# EAGLE schematic LRC (EAGLE 5.11)
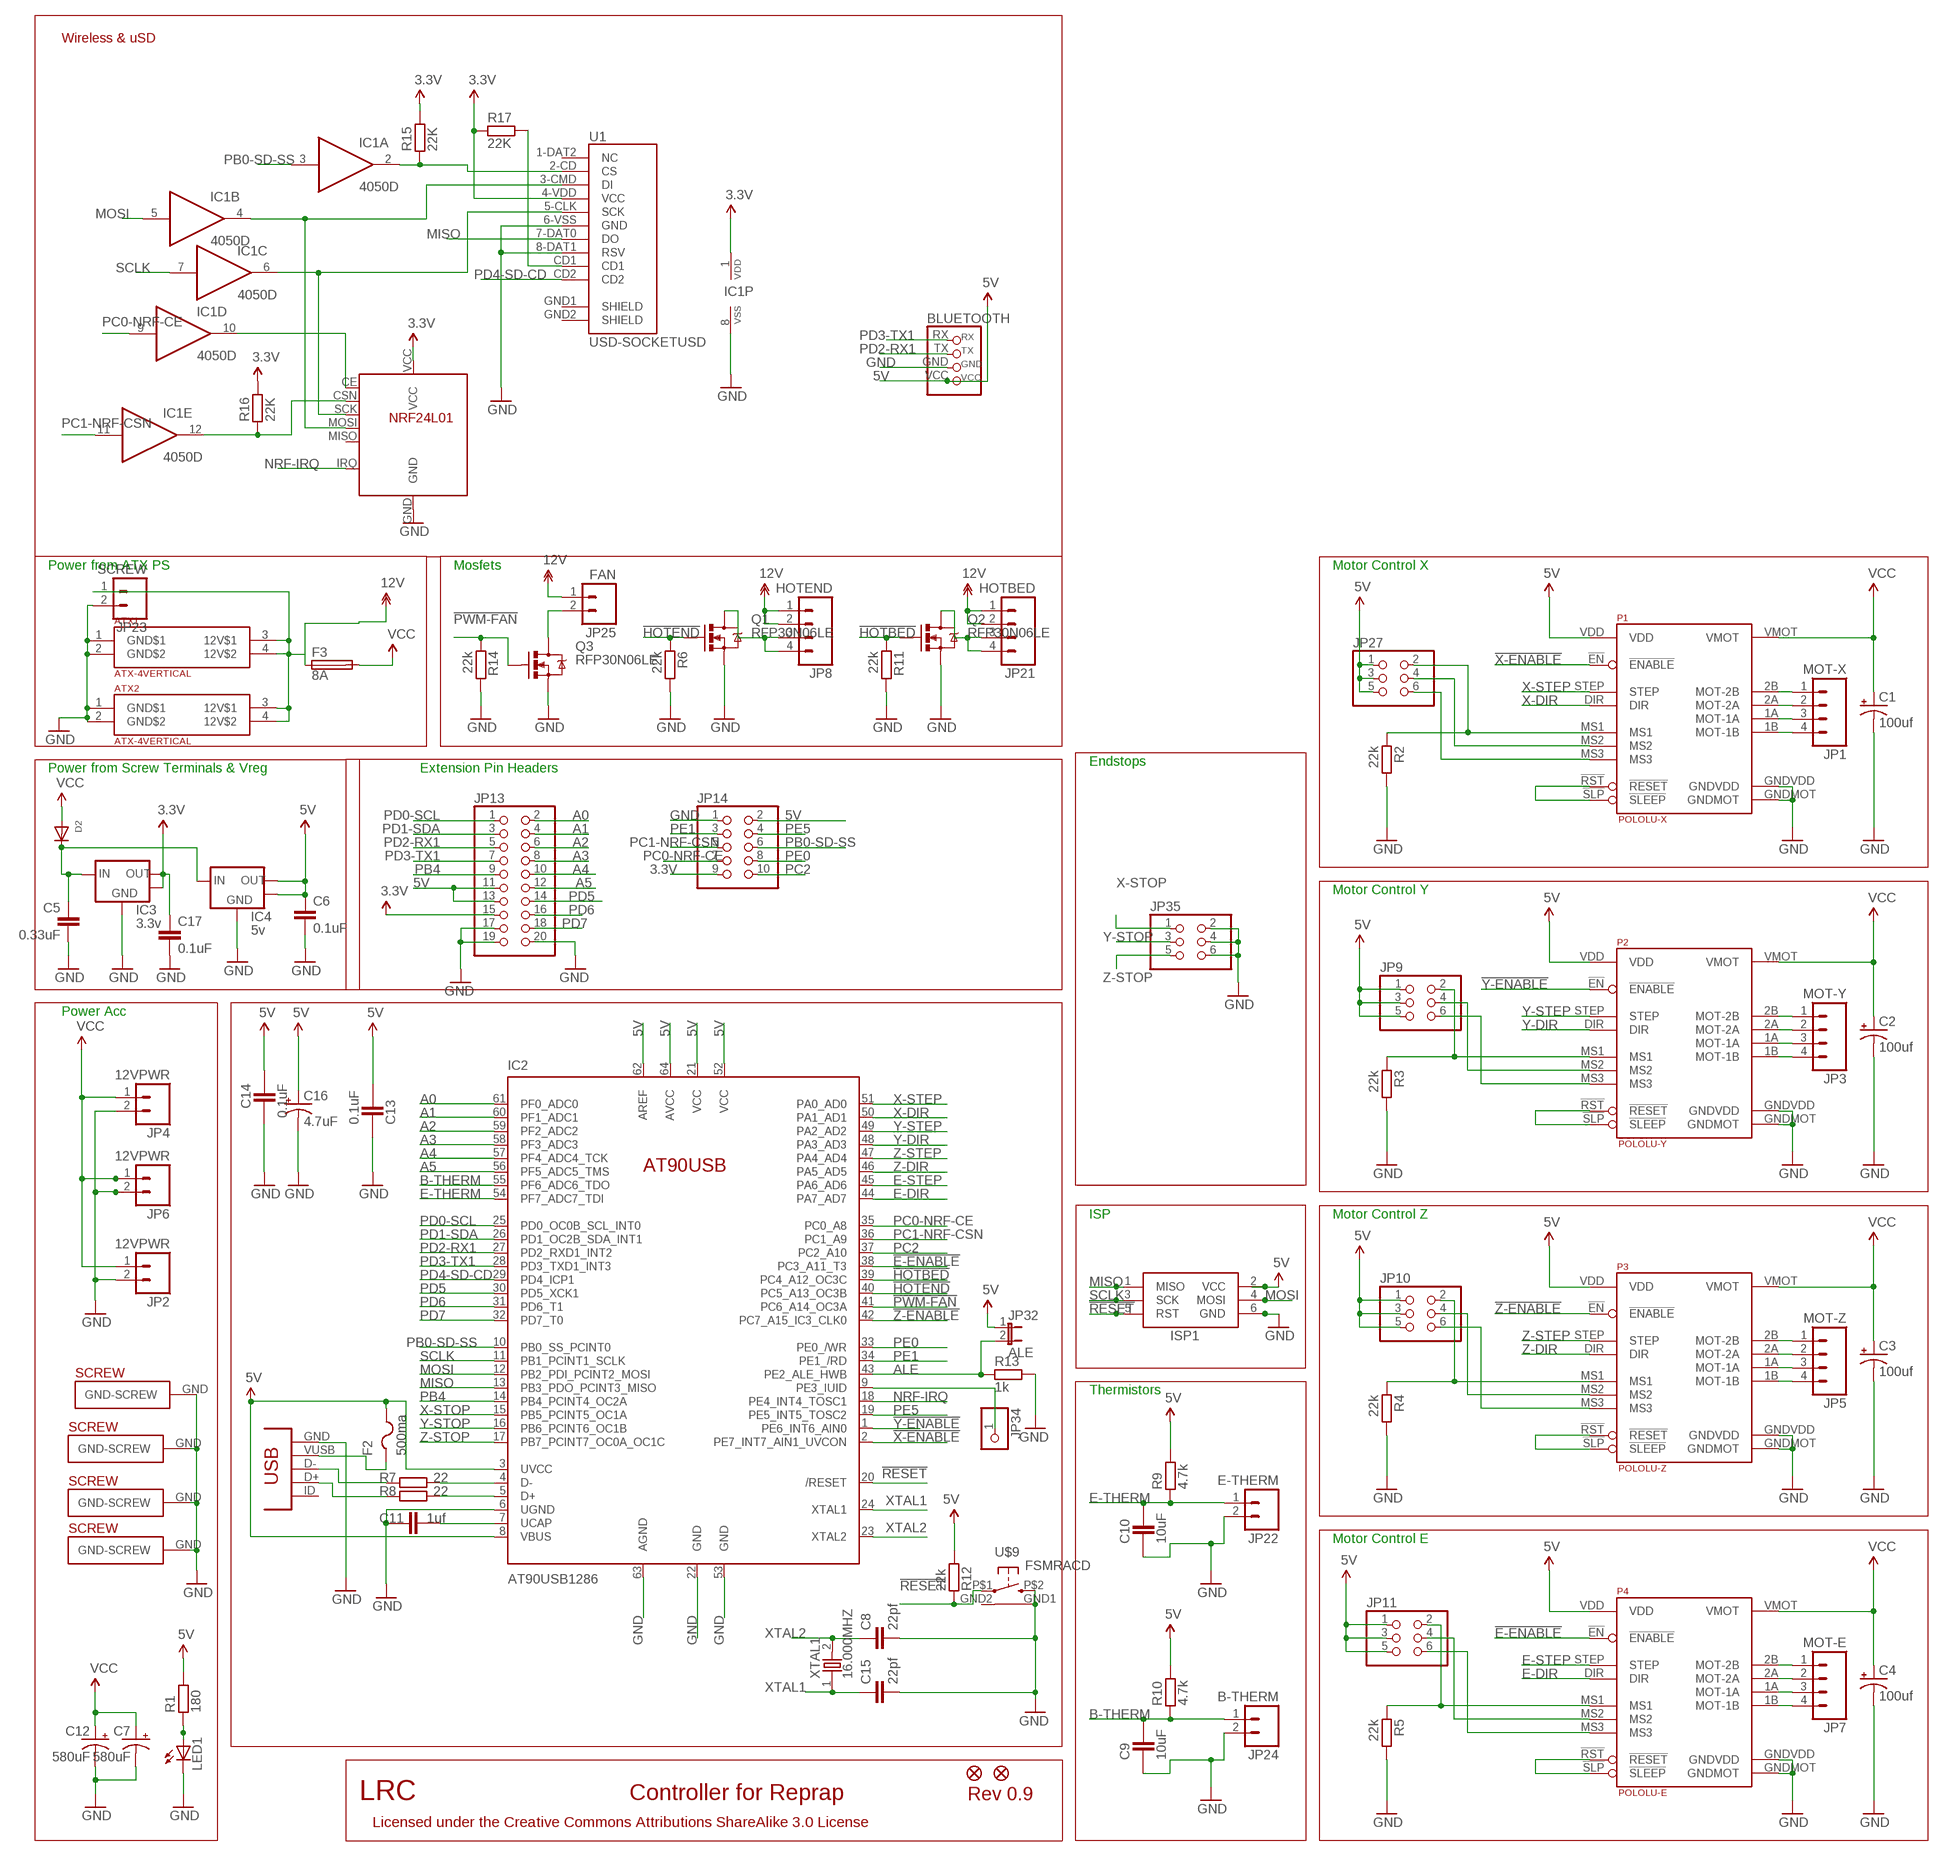
[diagram p0: schematic, sheet 1]

## Parts
ATX1  ATX-4VERTICAL  [MINIFITJR-4-VERTICAL]
ATX2  ATX-4VERTICAL  [MINIFITJR-4-VERTICAL]
BLUETOOTH  BLUETOOTH-BREAKOUT  [BLUETOOTH-BREAKOUT1X04]
C1  100uf  CAP_POLPTH1  [CPOL-RADIAL-100UF-25V]
C2  100uf  CAP_POLPTH1  [CPOL-RADIAL-100UF-25V]
C3  100uf  CAP_POLPTH1  [CPOL-RADIAL-100UF-25V]
C4  100uf  CAP_POLPTH1  [CPOL-RADIAL-100UF-25V]
C5  0.33uF  CAPPTH2  [CAP-PTH-SMALL2]
C6  0.1uF  CAPPTH2  [CAP-PTH-SMALL2]
C7  580uF  CAP_POLPTH4  [CPOL-RADIAL-1000UF-25V]
C8  22pf  CAPC805  [C805]
C9  10uF  CAPACITOR_0805  [CAPC2012X145AN]
C10  10uF  CAPACITOR_0805  [CAPC2012X145AN]
C11  1uf  CAPACITOR_0805  [CAPC2012X145AN]
C12  580uF  CAP_POLPTH4  [CPOL-RADIAL-1000UF-25V]
C13  0.1uF  CAPACITOR_0805  [CAPC2012X145AN]
C14  0.1uF  CAPACITOR_0805  [CAPC2012X145AN]
C15  22pf  CAPC805  [C805]
C16  4.7uF  CAP_POLPTH2  [CPOL-RADIAL-10UF-25V]
C17  0.1uF  CAPPTH2  [CAP-PTH-SMALL2]
D2  DIODESMA  [SMADIODE]
F2  500ma  PTCFUSE-1206  [R1206]
F3  8A  PTCFUSE  [LITTLEFUSE]
IC1  4050D  [SO16]
IC2  AT90USB1286  AT90USB  [TQFP64-2]
IC3  3.3v  V_REG_LM1117SOT223  [SOT223]
IC4  5v  V_REG_LM1117SOT223  [SOT223]
ISP1  AVRISP-6  [AVRISP]
JP1  MOT-X  M04POLAR  [MOLEX-1X4]
JP2  12VPWR  M02POLAR  [MOLEX-1X2]
JP3  MOT-Y  M04POLAR  [MOLEX-1X4]
JP4  12VPWR  M02POLAR  [MOLEX-1X2]
JP5  MOT-Z  M04POLAR  [MOLEX-1X4]
JP6  12VPWR  M02POLAR  [MOLEX-1X2]
JP7  MOT-E  M04POLAR  [MOLEX-1X4]
JP8  HOTEND  M04POLAR  [MOLEX-1X4]
JP9  PINHD-2X3  [2X03]
JP10  PINHD-2X3  [2X03]
JP11  PINHD-2X3  [2X03]
JP13  PINHD-2X10  [2X10]
JP14  PINHD-2X5  [2X05]
JP21  HOTBED  M04POLAR  [MOLEX-1X4]
JP22  E-THERM  M02PTH  [1X02]
JP23  SCREW  M025MM  [SCREWTERMINAL-5MM-2]
JP24  B-THERM  M02PTH  [1X02]
JP25  FAN  M02PTH  [1X02]
JP26  FIDUCIAL1X2.5  [FIDUCIAL-1X2.5]
JP27  PINHD-2X3  [2X03]
JP32  ALE  JUMPER-2PTH  [1X02]
JP33  FIDUCIAL1X2.5  [FIDUCIAL-1X2.5]
JP34  PINHD-1X1  [1X01]
JP35  PINHD-2X3  [2X03]
LED1  LEDCHIPLED_1206  [CHIPLED_1206]
P1  POLOLU-X  POLOLU-ALLEGRO  [POLOLU-ALLEGRO-PTH]
P2  POLOLU-Y  POLOLU-ALLEGRO  [POLOLU-ALLEGRO-PTH]
P3  POLOLU-Z  POLOLU-ALLEGRO  [POLOLU-ALLEGRO-PTH]
P4  POLOLU-E  POLOLU-ALLEGRO  [POLOLU-ALLEGRO-PTH]
Q1  RFP30N06LE  MOSFET-NCHANNELPTH2  [TO220V]
Q2  RFP30N06LE  MOSFET-NCHANNELPTH2  [TO220V]
Q3  RFP30N06LE  MOSFET-NCHANNELPTH2  [TO220V]
R1  180  RESISTOR_0805  [RESC2012X70N]
R2  22k  RESISTOR_0805  [RESC2012X70N]
R3  22k  RESISTOR_0805  [RESC2012X70N]
R4  22k  RESISTOR_0805  [RESC2012X70N]
R5  22k  RESISTOR_0805  [RESC2012X70N]
R6  22k  RESISTOR_0805  [RESC2012X70N]
R7  22  RESISTOR_0805  [RESC2012X70N]
R8  22  RESISTOR_0805  [RESC2012X70N]
R9  4.7k  RESISTOR_0805  [RESC2012X70N]
R10  4.7k  RESISTOR_0805  [RESC2012X70N]
R11  22k  RESISTOR_0805  [RESC2012X70N]
R12  22k  RESISTOR_0805  [RESC2012X70N]
R13  1k  RESISTOR_0805  [RESC2012X70N]
R14  22k  RESISTOR_0805  [RESC2012X70N]
R15  22K  RESISTOR_0805  [RESC2012X70N]
R16  22K  RESISTOR_0805  [RESC2012X70N]
R17  22K  RESISTOR_0805  [RESC2012X70N]
RF1  NRF24L01-BREAKOUT  [NRF24L01-BREAKOUT-ITEAD]
U1  USD-SOCKETUSD  [USD-SOCKET-PP]
U$8  PLATED-SCREW  [PLATEDSCREW]
U$9  FSMRACD  [FSMRACD]
U$17  PLATED-SCREW  [PLATEDSCREW]
U$24  PLATED-SCREW  [PLATEDSCREW]
U$37  PLATED-SCREW  [PLATEDSCREW]
USB1  CON-USB-MINI-BUSB1  [CONN_USB_MINI-B]
XTAL1  16.000MHZ  OSC-XTAL  [HC-49U-OR-DIP]

## Nets
3.3V: C17.1 IC1.1(P:VDD) IC3.2(VR-OUTSM) IC3.4(OUT) JP13.15 JP14.9 R15.2 R16.2 R17.1 RF1.VCC U1.4-VDD(VCC)
5V: BLUETOOTH.VCC(4.VCC) C6.1 C13.2 C14.1 C16.1(+) F2.2 IC2.3(UVCC) IC2.8(VBUS) IC2.21(VCC) IC2.52(VCC) IC2.62(AREF) IC2.64(AVCC) IC4.2(VR-OUTSM) IC4.4(OUT) ISP1.2(VCC) JP9.1 JP9.3 JP9.5 JP10.1 JP10.3 JP10.5 JP11.1 JP11.3 JP11.5 JP13.11 JP13.13 JP14.2 JP27.1 JP27.3 JP27.5 JP32.1 P1.VDD P2.VDD P3.VDD P4.VDD R1.2 R9.2 R10.2 R12.2
12V: ATX1.3(12V$1) ATX1.4(12V$2) ATX2.3(12V$1) ATX2.4(12V$2) F3.1 JP8.1 JP8.2 JP21.1 JP21.2 JP23.1 JP25.1
!E-ENABLE: IC2.38(PC3_A11_T3) P4.!EN(!ENABLE)
!HOTBED: IC2.39(PC4_A12_OC3C) Q2.1(G) R11.1
!HOTEND: IC2.40(PC5_A13_OC3B) Q1.1(G) R6.1
!PWM-FAN: IC2.41(PC6_A14_OC3A) Q3.1(G) R14.1
!RESET: IC2.20(/RESET) ISP1.5(RST) R12.1 U$9.P$1(P)
!X-ENABLE: IC2.2(PE7_INT7_AIN1_UVCON) P1.!EN(!ENABLE)
!Y-ENABLE: IC2.1(PE6_INT6_AIN0) P2.!EN(!ENABLE)
!Z-ENABLE: IC2.42(PC7_A15_IC3_CLK0) P3.!EN(!ENABLE)
A0: IC2.61(PF0_ADC0) JP13.2
A1: IC2.60(PF1_ADC1) JP13.4
A2: IC2.59(PF2_ADC2) JP13.6
A3: IC2.58(PF3_ADC3) JP13.8
A4: IC2.57(PF4_ADC4_TCK) JP13.10
A5: IC2.56(PF5_ADC5_TMS) JP13.12
ALE: IC2.43(PE2_ALE_HWB) JP32.2 R13.1
B-THERM: C9.2 IC2.55(PF6_ADC6_TDO) JP24.1 R10.1
E-DIR: IC2.44(PA7_AD7) P4.DIR
E-MOT-1A [power]: JP7.3 P4.1A(MOT-1A)
E-MOT-1B [power]: JP7.4 P4.1B(MOT-1B)
E-MOT-2A [power]: JP7.2 P4.2A(MOT-2A)
E-MOT-2B [power]: JP7.1 P4.2B(MOT-2B)
E-MS1: JP11.2 P4.MS1 R5.1
E-MS2: JP11.4 P4.MS2
E-MS3: JP11.6 P4.MS3
E-RESETSLEEP: P4.!RST(!RESET) P4.!SLP(!SLEEP)
E-STEP: IC2.45(PA6_AD6) P4.STEP
E-THERM: C10.2 IC2.54(PF7_ADC7_TDI) JP22.1 R9.1
GND [power]: ATX1.1(GND$1) ATX1.2(GND$2) ATX2.1(GND$1) ATX2.2(GND$2) BLUETOOTH.GND(3.GND) C1.2(-) C2.2(-) C3.2(-) C4.2(-) C5.2 C6.2 C7.2(-) C8.2 C9.1 C10.1 C11.1 C12.2(-) C13.1 C14.2 C15.2 C16.2(-) C17.2 IC1.8(P:VSS) IC2.6(UGND) IC2.22(GND) IC2.53(GND) IC2.63(AGND) IC3.1(GND) IC4.1(GND) ISP1.6(GND) JP2.2 JP4.2 JP6.2 JP13.17 JP13.19 JP13.20 JP14.1 JP22.2 JP23.2 JP24.2 JP35.2 JP35.4 JP35.6 LED1.C P1.GNDMOT P1.GNDVDD P2.GNDMOT P2.GNDVDD P3.GNDMOT P3.GNDVDD P4.GNDMOT P4.GNDVDD Q1.3(S) Q2.3(S) Q3.3(S) R2.2 R3.2 R4.2 R5.2 R6.2 R11.2 R13.2 R14.2 RF1.GND U1.6-VSS(GND) U1.8-DAT1(RSV) U$8.GND(GND-SCREW) U$9.GND1 U$9.P$2(S) U$17.GND(GND-SCREW) U$24.GND(GND-SCREW) U$37.GND(GND-SCREW) USB1.GND
HOTBED-GND [power]: JP21.3 JP21.4 Q2.2(D)
HOTEND-GND [power]: JP8.3 JP8.4 Q1.2(D)
MISO: IC2.13(PB3_PDO_PCINT3_MISO) ISP1.1(MISO) U1.7-DAT0(DO)
MOSI: IC1.5(B:I) IC2.12(PB2_PDI_PCINT2_MOSI) ISP1.4(MOSI)
N$1: LED1.A R1.1
N$2: R7.1 USB1.D-
N$3: IC2.4(D-) R7.2
N$4: IC2.5(D+) R8.2
N$5: R8.1 USB1.D+
N$6: JP25.2 Q3.2(D)
N$7: IC2.9(PE3_IUID) JP34.1
N$8: F2.1 USB1.VUSB
N$9: C11.2 IC2.7(UCAP)
N$10: R17.2 U1.CD1
N$11: IC1.12(E:O) R16.1 RF1.CSN
N$12: IC1.2(A:O) R15.1 U1.2-CD(CS)
N$13: IC1.4(B:O) RF1.MOSI U1.3-CMD(DI)
N$14: IC1.10(D:O) RF1.CE
N$16: C5.1 D2.C IC3.3(IN) IC4.3(IN)
N$17: IC1.6(C:O) RF1.SCK U1.5-CLK(SCK)
NRF-IRQ: IC2.18(PE4_INT4_TOSC1) RF1.IRQ
PB0-SD-SS: IC1.3(A:I) IC2.10(PB0_SS_PCINT0) JP14.6
PB4: IC2.14(PB4_PCINT4_OC2A) JP13.9
PC0-NRF-CE: IC1.9(D:I) IC2.35(PC0_A8) JP14.7
PC1-NRF-CSN: IC1.11(E:I) IC2.36(PC1_A9) JP14.5
PC2: IC2.37(PC2_A10) JP14.10
PD0-SCL: IC2.25(PD0_OC0B_SCL_INT0) JP13.1
PD1-SDA: IC2.26(PD1_OC2B_SDA_INT1) JP13.3
PD2-RX1: BLUETOOTH.TX(2.TX) IC2.27(PD2_RXD1_INT2) JP13.5
PD3-TX1: BLUETOOTH.RX(1.RX) IC2.28(PD3_TXD1_INT3) JP13.7
PD4-SD-CD: IC2.29(PD4_ICP1) U1.CD2
PD5: IC2.30(PD5_XCK1) JP13.14
PD6: IC2.31(PD6_T1) JP13.16
PD7: IC2.32(PD7_T0) JP13.18
PE0: IC2.33(PE0_/WR) JP14.8
PE1: IC2.34(PE1_/RD) JP14.3
PE5: IC2.19(PE5_INT5_TOSC2) JP14.4
SCLK: IC1.7(C:I) IC2.11(PB1_PCINT1_SCLK) ISP1.3(SCK)
VCC: C1.1(+) C2.1(+) C3.1(+) C4.1(+) C7.1(+) C12.1(+) D2.A F3.2 JP2.1 JP4.1 JP6.1 P1.VMOT P2.VMOT P3.VMOT P4.VMOT
X-DIR: IC2.50(PA1_AD1) P1.DIR
X-MOT-1A [power]: JP1.3 P1.1A(MOT-1A)
X-MOT-1B [power]: JP1.4 P1.1B(MOT-1B)
X-MOT-2A [power]: JP1.2 P1.2A(MOT-2A)
X-MOT-2B [power]: JP1.1 P1.2B(MOT-2B)
X-MS1: JP27.2 P1.MS1 R2.1
X-MS2: JP27.4 P1.MS2
X-MS3: JP27.6 P1.MS3
X-RESETSLEEP: P1.!RST(!RESET) P1.!SLP(!SLEEP)
X-STEP: IC2.51(PA0_AD0) P1.STEP
X-STOP: IC2.15(PB5_PCINT5_OC1A) JP35.1
XTAL1: C15.1 IC2.24(XTAL1) XTAL1.1
XTAL2: C8.1 IC2.23(XTAL2) XTAL1.2
Y-DIR: IC2.48(PA3_AD3) P2.DIR
Y-MOT-1A [power]: JP3.3 P2.1A(MOT-1A)
Y-MOT-1B [power]: JP3.4 P2.1B(MOT-1B)
Y-MOT-2A [power]: JP3.2 P2.2A(MOT-2A)
Y-MOT-2B [power]: JP3.1 P2.2B(MOT-2B)
Y-MS1: JP9.2 P2.MS1 R3.1
Y-MS2: JP9.4 P2.MS2
Y-MS3: JP9.6 P2.MS3
Y-RESETSLEEP: P2.!RST(!RESET) P2.!SLP(!SLEEP)
Y-STEP: IC2.49(PA2_AD2) P2.STEP
Y-STOP: IC2.16(PB6_PCINT6_OC1B) JP35.3
Z-DIR: IC2.46(PA5_AD5) P3.DIR
Z-MOT-1A [power]: JP5.3 P3.1A(MOT-1A)
Z-MOT-1B [power]: JP5.4 P3.1B(MOT-1B)
Z-MOT-2A [power]: JP5.2 P3.2A(MOT-2A)
Z-MOT-2B [power]: JP5.1 P3.2B(MOT-2B)
Z-MS1: JP10.2 P3.MS1 R4.1
Z-MS2: JP10.4 P3.MS2
Z-MS3: JP10.6 P3.MS3
Z-RESETSLEEP: P3.!RST(!RESET) P3.!SLP(!SLEEP)
Z-STEP: IC2.47(PA4_AD4) P3.STEP
Z-STOP: IC2.17(PB7_PCINT7_OC0A_OC1C) JP35.5
Unconnected: IC1.14(F:I) IC1.15(F:O) RF1.MISO U1.1-DAT2(NC) U1.GND1(SHIELD) U1.GND2(SHIELD) U$9.GND2 USB1.BODY@1(BODY) USB1.BODY@2(BODY) USB1.BODY@3(BODY) USB1.BODY@4(BODY) USB1.ID(USBID)

## Notes on the sheet
- Wireless & uSD
- Power from ATX PS | Mosfets | Motor Control X
- Endstops
- Power from Screw Terminals & Vreg | Extension Pin Headers
- Motor Control Y
- Power Acc
- ISP | Motor Control Z
- Thermistors
- Motor Control E
- LRC | Controller for Reprap | Rev 0.9
- Licensed under the Creative Commons Attributions ShareAlike 3.0 License

## Library data of the parts
ATX1 ATX2 = atx-power-supply:ATX-4
BLUETOOTH = LL:BLUETOOTH-BREAKOUT: PIN HEADER
C1-C4 C7 C12 C16 = SparkFun:CAP_POL: Capacitor Polarized These are standard SMD and PTH capacitors. Normally 10uF, 47uF, and 100uF in electrolytic and tantalum varieties. Always verify the external diameter of the through hole cap, it varies with capacity, voltage, and manufacturer. The EIA devices should be standard.
C5 C6 C17 = SparkFun:CAP: Capacitor Standard 0603 ceramic capacitor, and 0.1" leaded capacitor.
C8 C15 = dp_devices:CAP
C9-C11 C13 C14 = ipc-7351-capacitor:CAPACITOR_
D2 = adafruit:DIODE: Diode SMADIODE - SMA Surface Mount Package 20V 1A Schottky Diode Digikey: 641-1014-6-ND DO-1N4148 - Through Hole Small Current Diode SOD-123 20V 1 A (.5mV Vf) Schottky Diode - Digikey: MBRX120TPMSCT-ND SOD-323 10V 570mA (.38mV Vf, 3ns) Schottky Diode - Digikey: ZLLS410CT-ND SOD-523 30V 30mA Schottky Diode (RB751S-40TE61) - Digikey: RB751S-40TE61CT-ND SOT23-R/W - SOT23 Package (R = Solder Paste/Reflow Ovens, W = Hand-Soldering) BAT54Film 40V 300mA - Digikey: 497-7162-1-ND
F2 = adafruit:PTCFUSE: PTC fuses, resettable thermistors
F3 = RepRapjr:PTCFUSE: LITTLEFUSE Picofuse/slow Littlefuse
IC1 = 40xx:4050: Hex non-inverting BUFFER
IC2 = Atmel-at90usb-teensy:AT90USB
IC3 IC4 = LL:V_REG_LM1117: Voltage Regulator LM1117 Standard adjustable voltage regulator but in SMD form. Fixed voltage type.
ISP1 = adafruit:AVRISP: AVR ISP HEADER Standard 6 pin header for AVR programming
JP1 JP3 JP5 JP7 JP8 JP21 = SparkFun:M04: Header 4 Standard 4-pin 0.1" header. Use with straight break away headers (SKU : PRT-00116), right angle break away headers (PRT-00553), swiss pins (PRT-00743), machine pins (PRT-00117), and female headers (PRT-00115). Molex polarized connector foot print use with SKU : PRT-08231 with associated crimp pins and housings. 1MM SMD Version SKU: PRT-10208
JP2 JP4 JP6 JP22-JP25 = SparkFun:M02: Header 2 Standard 2-pin 0.1" header. Use with straight break away headers (SKU : PRT-00116), right angle break away headers (PRT-00553), swiss pins (PRT-00743), machine pins (PRT-00117), and female headers (PRT-00115). Molex polarized connector foot print use with SKU : PRT-08233 with associated crimp pins and housings.
JP9-JP11 JP27 = SparkFun:PINHD-2X3: PIN HEADER
JP13 = SparkFun:PINHD-2X10: PIN HEADER
JP14 = pinhead:PINHD-2X5: PIN HEADER
JP26 JP33 = SparkFun:FIDUCIAL: Fiducial Alignment Points Various fiducial points for machine vision alignment.
JP32 = SparkFun:JUMPER-2: Jumper Basic 0.1" spaced jumper. Use with breakaway headers.
JP34 = pinhead:PINHD-1X1: PIN HEADER
JP35 = pinhead:PINHD-2X3: PIN HEADER
LED1 = led:LED: LED OSRAM: - CHIPLED LG R971, LG N971, LY N971, LG Q971, LY Q971, LO R971, LY R971 LH N974, LH R974 LS Q976, LO Q976, LY Q976 LO Q996 - Hyper CHIPLED LW Q18S LB Q993, LB Q99A, LB R99A - SideLED LS A670, LO A670, LY A670, LG A670, LP A670 LB A673, LV A673, LT A673, LW A673 LH A674 LY A675 LS A676, LA A676, LO A676, LY A676, LW A676 LS A679, LY A679, LG A679 - Hyper Micro SIDELED® LS Y876, LA Y876, LO Y876, LY Y876 LT Y87S - SmartLED LW L88C, LW L88S LB L89C, LB L89S, LG L890 LS L89K, LO L89K, LY L89K LS L896, LA L896, LO L896, LY L896 - TOPLED LS T670, LO T670, LY T670, LG T670, LP T670 LSG T670, LSP T670, LSY T670, LOP T670, LYG T670 LG T671, LOG T671, LSG T671 LB T673, LV T673, LT T673, LW T673 LH T674 LS T676, LA T676, LO T676, LY T676, LB T676, LH T676, LSB T676, LW T676 LB T67C, LV T67C, LT T67C, LS T67K, LO T67K, LY T67K, LW E67C LS E67B, LA E67B, LO E67B, LY E67B, LB E67C, LV E67C, LT E67C LW T67C LS T679, LY T679, LG T679 LS T770, LO T770, LY T770, LG T770, LP T770 LB T773, LV T773, LT T773, LW T773 LH T774 LS E675, LA E675, LY E675, LS T675 LS T776, LA T776, LO T776, LY T776, LB T776 LHGB T686 LT T68C, LB T68C - Hyper Mini TOPLED® LB M676 - Mini TOPLED Santana® LG M470 LS M47K, LO M47K, LY M47K Source: http://www.osram.convergy.de LUXEON: - LUMILED® LXK2-PW12-R00, LXK2-PW12-S00, LXK2-PW14-U00, LXK2-PW14-V00 LXK2-PM12-R00, LXK2-PM12-S00, LXK2-PM14-U00 LXK2-PE12-Q00, LXK2-PE12-R00, LXK2-PE12-S00, LXK2-PE14-T00, LXK2-PE14-U00 LXK2-PB12-K00, LXK2-PB12-L00, LXK2-PB12-M00, LXK2-PB14-N00, LXK2-PB14-P00, LXK2-PB14-Q00 LXK2-PR12-L00, LXK2-PR12-M00, LXK2-PR14-Q00, LXK2-PR14-R00 LXK2-PD12-Q00, LXK2-PD12-R00, LXK2-PD12-S00 LXK2-PH12-R00, LXK2-PH12-S00 LXK2-PL12-P00, LXK2-PL12-Q00, LXK2-PL12-R00 Source: www.luxeon.com KINGBRIGHT: KA-3528ASYC Source: www.kingbright.com
P1-P4 = pololu-allegro:POLOLU-ALLEGRO
Q1-Q3 = SparkFun:MOSFET-NCHANNEL
R1-R17 = ipc-7351-resistor:RESISTOR_
RF1 = LL:NRF24L01-BREAKOUT: NRF23L01 breakout; FREQ: 2.4GHZ
U1 = LL:USD-SOCKET: microSD Socket Push-push type uSD socket. Based on Hirose DM3D-SF
U$8 U$17 U$24 U$37 = Sanguinololu:PLATED-SCREW
U$9 = LL:FSMRACD
USB1 = dp_devices:CON-USB-MINI-B: USB connector
XTAL1 = LL:OSC-XTAL: HC49U crystal with Thru Hole Option